# EasyEDA Pro project EasyEDAPro_River Gauge Rev 2_2026-01-11.epro

# Schematic Schematic1
Board Name: Board1; Create Date: 2026-01-03; Page Name: P1; Project Name: River Gauge Rev 2; Schematic Name: Schematic1; Update Date: 2026-01-04; Company: EasyEDA.com; Page Size: A4; Version: V1.0
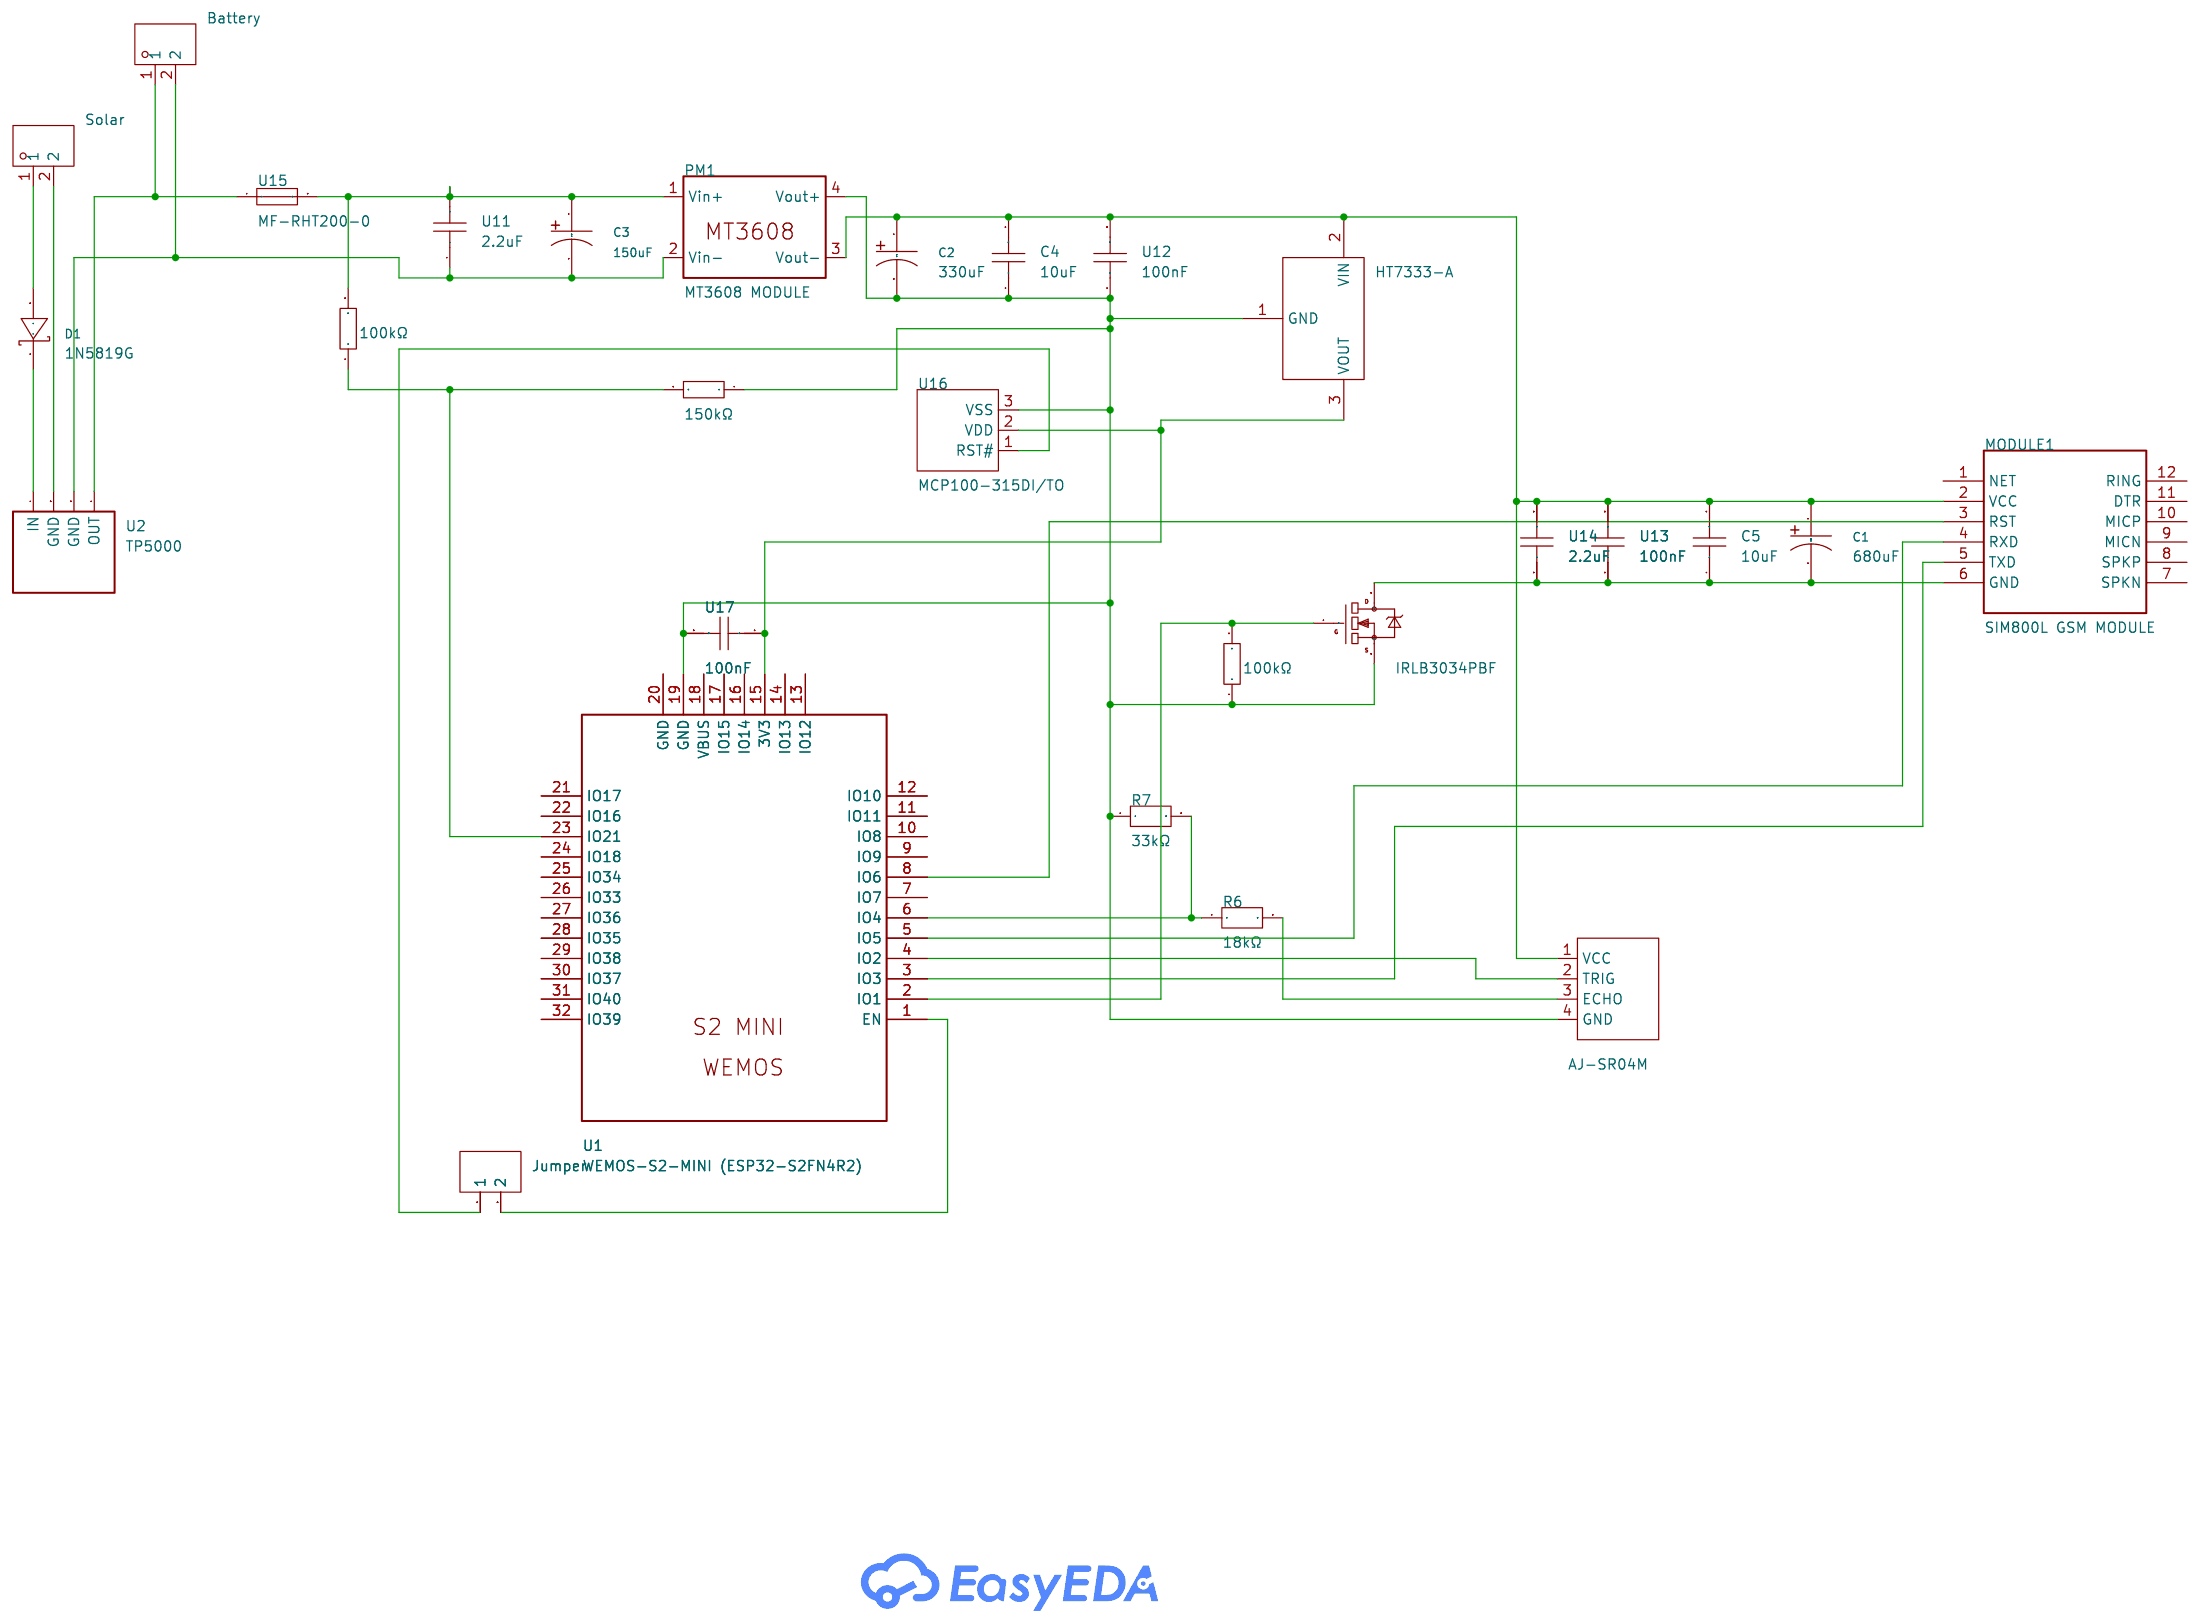
[diagram p0: schematic sheet]

## Parts
C1  680uF  [CAP-TH_BD8.0-P3.50-D0.6-FD_1]
C2  330uF  [CAP-TH_BD6.3-P2.50-D1.0-FD]
C3  150uF  [CAP-TH_BD6.3-P2.50-D1.0-FD]
C4  10uF  [CAP-TH_L4.5-W3.0-P2.50-D0.5]
C5  10uF  [CAP-TH_L4.5-W3.0-P2.50-D0.5]
D1  1N5819G  [DO-41_BD2.4-L4.7-P8.70-D0.9-RD]
H1  Jumper  [HDR-TH_2P-P2.54-V-F]
MODULE1  SIM800L GSM MODULE  [SIM800L GSM MODULE]
PM1  MT3608 MODULE  [MT3608]
Q2  IRLB3034PBF  [TO-220-3_L10.0-W4.5-P2.54-L]
R2  100kΩ  [RES-TH_BD4.5-L11.0-P15.00-D0.7]
R3  100kΩ  [RES-TH_BD4.5-L11.0-P15.00-D0.7]
R4  150kΩ  [RES-TH_BD4.5-L11.0-P15.00-D0.7]
R6  18kΩ  [RES-TH_BD2.4-L6.5-P10.50-D0.5]
R7  33kΩ  [RES-TH_BD2.4-L6.5-P10.50-D0.5]
U1  WEMOS-S2-MINI (ESP32-S2FN4R2)  [WEMOS-S2-MINI]
U2  TP5000  [TP5000]
U7  Solar  [CONN-TH_2P-P3.50_KEFA_KF2EDGJVC-3.5-2P]
U8  Battery  [CONN-TH_2P-P3.50_KEFA_KF2EDGJVC-3.5-2P]
U9  AJ-SR04M  [TH_HC-SR04V]
U10  HT7333-A  [TO-92-3_L5.1-W4.1-P1.27-L]
U11  2.2uF  [CAP-TH_L4.0-W2.5-P2.50-D0.5]
U12  100nF  [CAP-TH_L3.6-W2.3-P2.5-D0.6]
U13  100nF  [CAP-TH_L3.6-W2.3-P2.5-D0.6]
U14  2.2uF  [CAP-TH_L4.0-W2.5-P2.50-D0.5]
U15  MF-RHT200-0  [FUSE-TH_L9.4-W3.0-P5.10-D1.0-S2.10]
U16  MCP100-315DI/TO  [TO-92-3_L4.8-W3.7-P1.27-L]
U17  100nF  [CAP-TH_L3.6-W2.3-P2.5-D0.6]

## Library data of the parts
C1 = EEUFR1A681: Capacitance: Tolerance:±20% Tolerance:±20% Rated Voltage: Ripple Current:950mA@100kHz Equivalent Series Resistance(ESR):56mΩ@100kHz Lead Spacing: φD: L: Lifetime @ Temp:6000hrs@105℃ Operating Temperature:-40℃~+105℃ Operating Temperature:-40℃~+105℃; LCSC Part Name: 680uF ±20% 10V; Supplier Part: C407875; Manufacturer: PANASONIC(松下); Supplier Footprint: 插件,D8xL11.5mm; JLCPCB Part Class: Extended Part; Datasheet: https://atta.szlcsc.com/upload/public/pdf/source/20190724/C407875_2DF9F4B12A7B6FBBCD5E74906427567A.pdf; Supplier: LCSC; Tolerance: ±20%; Ripple Current: 950mA@100kHz; Equivalent Series Resistance(ESR): 56mΩ@100kHz; Lifetime @ Temp: 6000hrs@105℃; Operating Temperature: -40℃~+105℃
C2 C3 = EEUFS1A331: Capacitance:330uF Tolerance:±20% Tolerance:±20% Voltage Rating:10V Ripple Current:455mA@100kHz Equivalent Series Resistance(ESR):130mΩ@100kHz Pin Spacing:2.5mm Diameter:6.3mm Height - Seated (Max):11.2mm Lifetime:5000hrs@105℃ Operating Temperature:-40℃~+1; LCSC Part Name: 330uF ±20% 10V; Supplier Part: C407971; Manufacturer: PANASONIC(松下); Supplier Footprint: 插件,D6.3xL11.2mm; JLCPCB Part Class: Extended Part; Datasheet: https://item.szlcsc.com/datasheet/EEUFS1A331/396950.html; Supplier: LCSC; Tolerance: ±20%; Voltage Rating: 10V; Ripple Current: 455mA@100kHz; Equivalent Series Resistance(ESR): 130mΩ@100kHz; Pin Spacing: 2.5mm; Diameter: 6.3mm; Height - Seated (Max): 11.2mm; Lifetime: 5000hrs@105℃; Operating Temperature: -40℃~+105℃
C4 C5 = FG14X7R1A106KRT06: Capacitance: Tolerance:±10% Tolerance:±10% Voltage Rated:10V Temperature Coefficient:; LCSC Part Name: 10uF ±10% 10V; Supplier Part: C1623406; Manufacturer: TDK; Supplier Footprint: 插件; JLCPCB Part Class: Extended Part; Datasheet: https://atta.szlcsc.com/upload/public/pdf/source/20210603/7C07ADBE9CEF1AEE8735D13453ED6990.pdf; Supplier: LCSC; Tolerance: ±10%; Voltage Rated: 10V
D1 = 1N5819G: Voltage - Forward(Vf@If):600mV@1A Voltage - DC Reverse(Vr):40V Current - Rectified:1A Reverse Leakage Current (Ir):1mA@40V Operating Junction Temperature Range:-65℃~+125℃ Operating Junction Temperature Range:-65℃~+125℃ Non-Repetitive Peak Forward Surge Cu; LCSC Part Name: 电压:40V 电流:1A; Supplier Part: C232463; Manufacturer: onsemi(安森美); Supplier Footprint: DO-41; JLCPCB Part Class: Extended Part; Datasheet: https://item.szlcsc.com/datasheet/1N5819G/232386.html; Supplier: LCSC; Voltage - Forward(Vf@If): 600mV@1A; Voltage - DC Reverse(Vr): 40V; Current - Rectified: 1A; Reverse Leakage Current (Ir): 1mA@40V; Operating Junction Temperature Range: -65℃~+125℃; Non-Repetitive Peak Forward Surge Current: 25A
H1 = HDR-F_2.54_1x2P: Supplier Footprint: Through
MODULE1 = SIM800L GSM MODULE
PM1 = MT3608 MODULE: Supplier: AliExpress; link: https://www.banggood.com/1pcs-MT3608-2A-DC-DC-Adjustable-Step-Up-Power-Module-Booster-Power-Module-p-1213134.html?rmmds=myorder&cur_warehouse=CN
Q2 = IRLB3034PBF: Type:1个NChannel Drain Source Voltage (Vdss): Continuous Drain Current (Id): Power Dissipation (Pd): Drain Source On Resistance (RDS(on)@Vgs,Id):1.7mΩ@10V,195A Gate Threshold Voltage (Vgs(th)@Id):2.5V@250uA Total Gate Charge (Qg@Vgs):162nC@4.5V Input Capac; LCSC Part Name: 1个N沟道 耐压:40V 电流:195A; Supplier Part: C144151; Manufacturer: Infineon(英飞凌); Supplier Footprint: TO-220AB; JLCPCB Part Class: Extended Part; Datasheet: https://atta.szlcsc.com/upload/public/pdf/source/20171120/C148141_15111593205491130465.pdf; Supplier: LCSC; Type: 1个NChannel; Drain Source On Resistance (RDS(on)@Vgs,Id): 1.7mΩ@10V,195A; Gate Threshold Voltage (Vgs(th)@Id): 2.5V@250uA; Total Gate Charge (Qg@Vgs): 162nC@4.5V; Input Capacitance (Ciss@Vds): 10.315nF@25V; Operating Temperature: -55℃~+175℃@(Tj)
R2-R4 = MO2WS-100K±5%-TT63: Type:Metal Oxide Resistors Resistance:100kΩ Tolerance:±5% Tolerance:±5% Voltage-Supply(Max):400V Power(Watts):2W Temperature Coefficient:±350ppm/℃ Temperature Coefficient:±350ppm/℃ Operating Temperature:-55℃~+155℃ Operating Temperature:-55℃~+155℃; LCSC Part Name: 金属氧化膜电阻 100kΩ ±5% 2W 小体积; Supplier Part: C479462; Manufacturer: VO(翔胜); Supplier Footprint: 插件,D4.5xL11mm; JLCPCB Part Class: Extended Part; Datasheet: https://atta.szlcsc.com/upload/public/pdf/source/20200622/C479426_3144C92B6E787A18688D073F1B971656.pdf; Supplier: LCSC; Type: Metal Oxide Resistors; Tolerance: ±5%; Voltage-Supply(Max): 400V; Power(Watts): 2W; Temperature Coefficient: ±350ppm/℃; Operating Temperature: -55℃~+155℃
R6 R7 = RNF14FTC18K0: Type:Metal Film Resistors Resistance: Tolerance:±1% Tolerance:±1% Power(Watts):0.25W Temperature Coefficient:±50ppm/℃ Temperature Coefficient:±50ppm/℃ Operating Temperature Range:-55℃~+155℃ Operating Temperature Range:-55℃~+155℃; LCSC Part Name: 金属膜电阻 18kΩ ±1% 250mW; Supplier Part: C2588075; Manufacturer: SEI(Stackpole Electronics Inc.); Supplier Footprint: 插件,D2.4xL6.4mm; JLCPCB Part Class: Extended Part; Datasheet: https://atta.szlcsc.com/upload/public/pdf/source/20210416/CE3C3DFE1F0E2A8D22EC743938724C43.pdf; Supplier: LCSC; Type: Metal Film Resistors; Tolerance: ±1%; Power(Watts): 0.25W; Temperature Coefficient: ±50ppm/℃; Operating Temperature Range: -55℃~+155℃
U1 = WEMOS-S2-MINI (ESP32-S2FN4R2): Manufacturer: WEMOS; Manufacturer Part: Wemos; Supplier: WEMOS; Supplier Part: WEMOS_S2_MINI; link: https://www.wemos.cc/en/latest/s2/s2_mini.html?spm=a2g0o.detail.1000023.1.36da1596ZoDwKF
U2 = TP5000
U7 U8 = KF2EDGJVC-3.5-2P: Supplier Part: C9900094985; Supplier Footprint: CONN-TH_3P-P3.50_KEFA_KF2EDGJVC-3.5-2P; JLCPCB Part Class: Extended Part; Supplier: LCSC
U9 = HC-SR04: Supplier Part: C19857336; Manufacturer: Universal Microelectronics; JLCPCB Part Class: Extended Part; Datasheet: https://atta.szlcsc.com/upload/public/pdf/source/20240122/47B8E374E428935B7962A2189EF91AAC.pdf; Supplier: LCSC
U10 = HT7333-A: Output Type: Maximum Input Voltage:- Output Voltage:3.3V Output Voltage:3.3V MAX Output Current:- Power Supply Rejection Ratio (PSRR):- Dropout Voltage:- standby current:- Output Polarity:Positive electrode Number of Outputs:1; LCSC Part Name: 输出3.3V; Supplier Part: C73726; Manufacturer: HOLTEK(合泰/盛群); Supplier Footprint: TO-92-3; JLCPCB Part Class: Extended Part; Supplier: LCSC; Output Voltage: 3.3V; Output Polarity: Positive electrode; Number of Outputs: 1
U11 U14 = FG18X7R1A225KRT06: Capacitance: Tolerance:±10% Tolerance:±10% Voltage Rated:10V Temperature Coefficient:; LCSC Part Name: 2.2uF ±10% 10V; Supplier Part: C3693923; Manufacturer: TDK; JLCPCB Part Class: Extended Part; Supplier: LCSC; Tolerance: ±10%; Voltage Rated: 10V
U12 U13 U17 = K104K15X7RF53L2: Capacitance:100nF Tolerance:±10% Tolerance:±10% Voltage Rating:50V Temperature Coefficient:X7R; LCSC Part Name: 100nF ±10% 50V; Supplier Part: C1620173; Manufacturer: VISHAY(威世); Supplier Footprint: 插件,P=2.5mm; JLCPCB Part Class: Extended Part; Datasheet: https://item.szlcsc.com/datasheet/K104K15X7RF53L2/1711018.html; Supplier: LCSC; Tolerance: ±10%; Voltage Rating: 50V; Temperature Coefficient: X7R
U15 = MF-RHT200-0: Voltage - Max:- Current - Max:- Hold Current:- Trip Current:- Power Dissipation:1.4W Resistance - Initial (Ri) (Min):45mΩ Resistance - Post Trip (R1) (Max):110mΩ Time to Trip(Max):- Operating Temperature:-40℃~+125℃ Operating Temperature:-40℃~+125℃ Length:; Supplier Part: C3762533; Manufacturer: BOURNS; Supplier Footprint: 插件,P=5.1mm; JLCPCB Part Class: Extended Part; Datasheet: https://item.szlcsc.com/datasheet/MF-RHT200-0/4330064.html; Supplier: LCSC; Power Dissipation: 1.4W; Resistance - Initial (Ri) (Min): 45mΩ; Resistance - Post Trip (R1) (Max): 110mΩ; Operating Temperature: -40℃~+125℃
U16 = MCP100-315DI/TO: ChipType:Simple Reset/Power-On Reset Output Type:Push-pull Voltage - Supply:1V~5.5V Voltage - Supply:1V~5.5V Reset Active Level:Active Low Threshold Voltage:3.075V Number of Voltages Monitored:1 Reset Timeout:150ms Operating Temperature:-40℃~+85℃@(TA) Ope; LCSC Part Name: 带推挽输出的微控制器监控电路; Supplier Part: C631713; Manufacturer: MICROCHIP(美国微芯); Supplier Footprint: TO-92; JLCPCB Part Class: Extended Part; Datasheet: https://item.szlcsc.com/datasheet/MCP100-315DI%252FTO/661523.html; Supplier: LCSC; ChipType: Simple Reset/Power-On Reset; Output Type: Push-pull; Voltage - Supply: 1V~5.5V; Reset Active Level: Active Low; Threshold Voltage: 3.075V; Number of Voltages Monitored: 1; Reset Timeout: 150ms; Operating Temperature: -40℃~+85℃@(TA); Quiescent Current: 45uA

## Nets
$1N656: C1.2 C5.1 MODULE1.6(GND) Q2.2(D) U13.1 U14.1
$1N895: D1.2(A) U7.1
$1N900: U2.3(GND) U7.2
$1N906: C3.2 PM1.2(Vin-) U2.2(GND) U8.2 U11.1
$1N1032: H1.1 U16.1(RST#)
$1N1812: D1.1(K) U2.4(IN)
$1N1973: C3.1 PM1.1(Vin+) R3.2 U11.2 U15.2
$1N1979: U2.1(OUT) U8.1 U15.1
$1N2137: H1.2 U1.1(EN)
$1N2311: U1.15(3V3) U10.3(VOUT) U16.2(VDD) U17.1
$1N2333: MODULE1.5(TXD) U1.3(IO3)
$1N2338: MODULE1.3(RST) U1.8(IO6)
$1N2360: Q2.1(G) R2.2 U1.2(IO1)
$1N2448: MODULE1.4(RXD) U1.5(IO5)
$1N2559: U1.4(IO2) U9.2(TRIG)
$1N2629: C2.2 C4.1 PM1.4(Vout+) Q2.3(S) R2.1 R4.1 R7.1 U1.19(GND) U9.4(GND) U10.1(GND) U12.1 U16.3(VSS) U17.2
$1N2646: C1.1 C2.1 C4.2 C5.2 MODULE1.2(VCC) PM1.3(Vout-) U9.1(VCC) U10.2(VIN) U12.2 U13.2 U14.2
$1N2699: R3.1 R4.2 U1.23(IO21)
$1N2824: R6.2 U9.3(ECHO)
$1N2827: R6.1 R7.2 U1.6(IO4)

Not connected (* = marked no-connect by the designer): MODULE1 1(NET) 7(SPKN) 8(SPKP) 9(MICN) 10(MICP) 11(DTR) 12(RING); U1 7(IO7) 9(IO9) 10(IO8) 11(IO11) 12(IO10) 13(IO12) 14(IO13) 16(IO14) 17(IO15) 18(VBUS) 20(GND) 21(IO17) 22(IO16) 24(IO18) 25(IO34) 26(IO33) 27(IO36) 28(IO35) 29(IO38) 30(IO37) 31(IO40) 32(IO39)

# Board PCB1
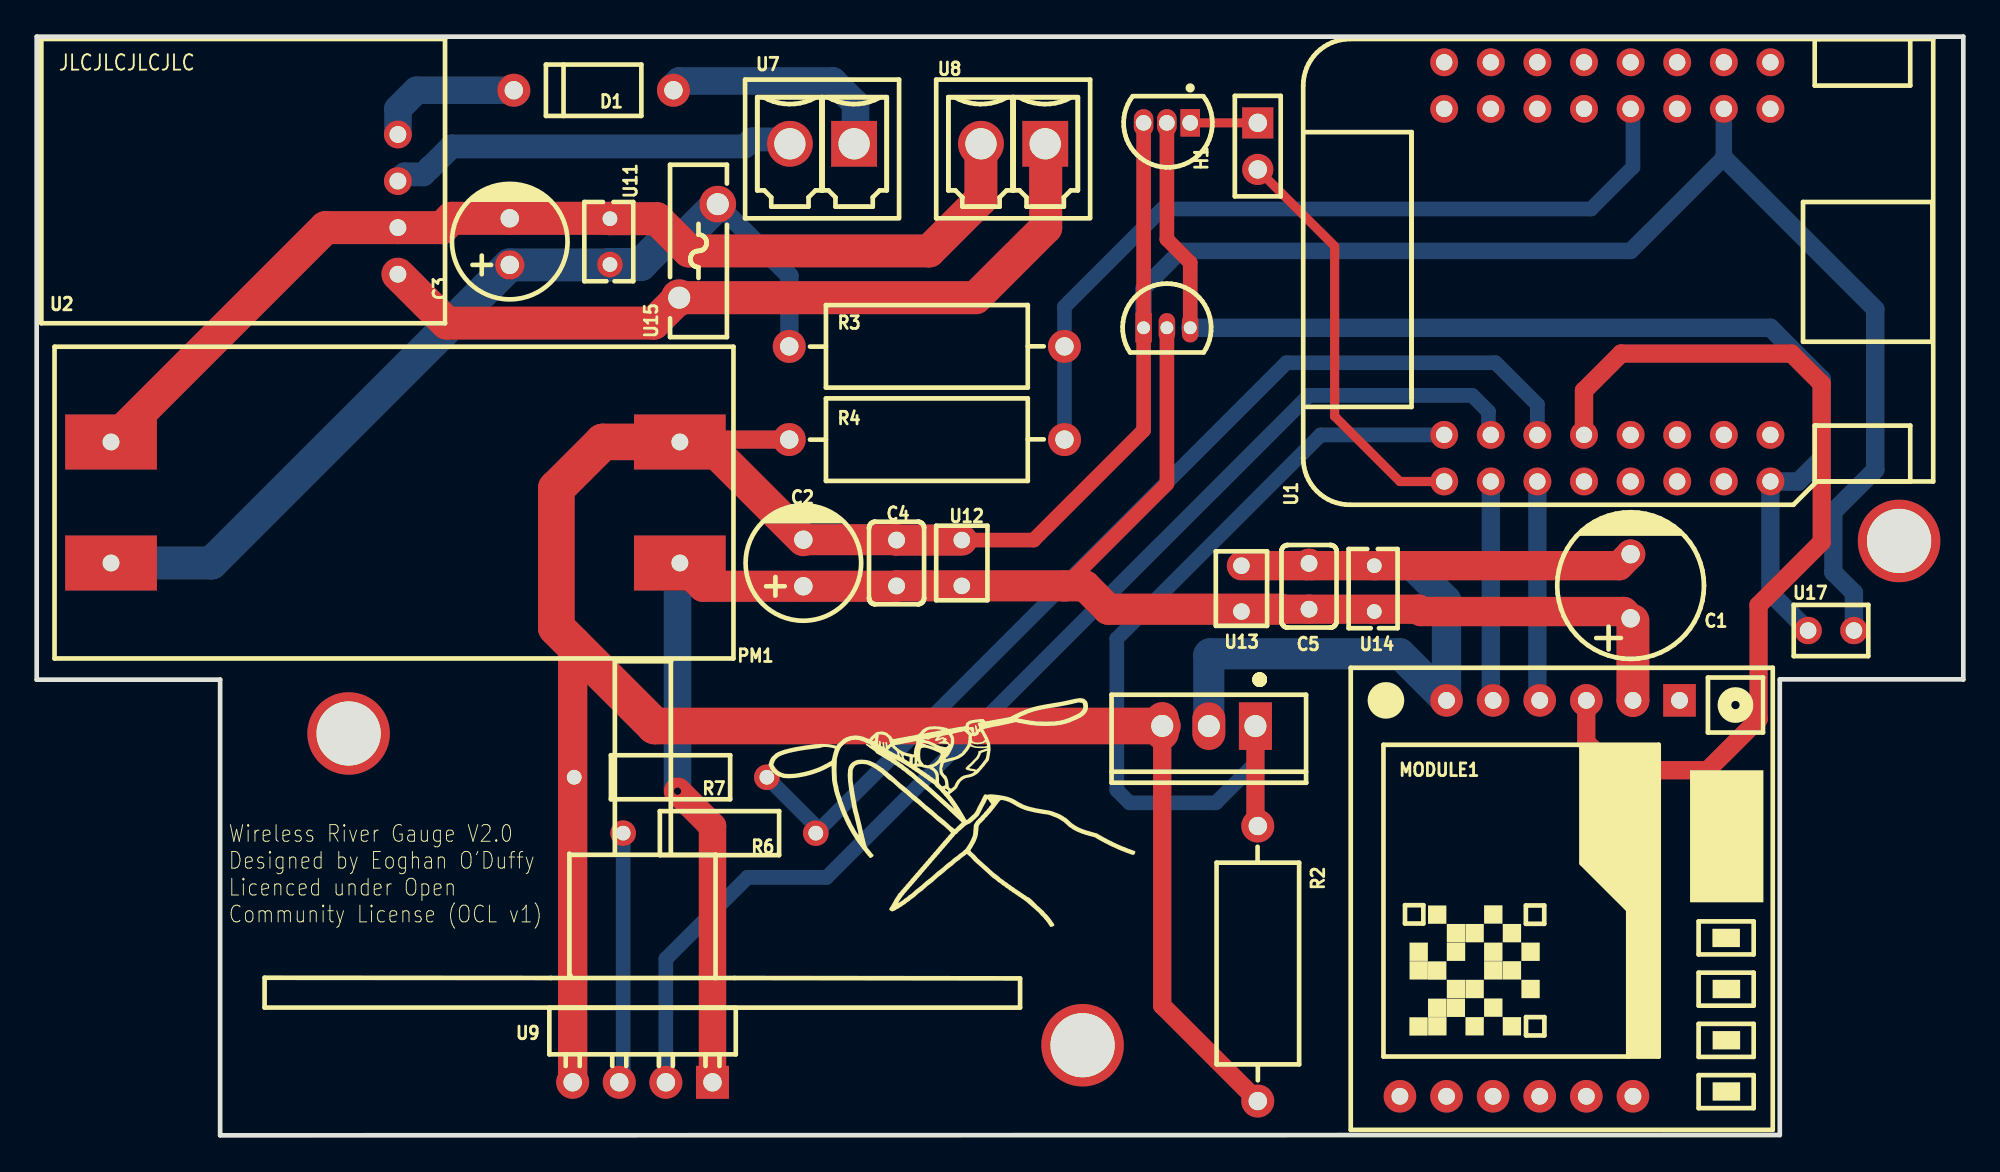
[diagram p1: board, top side]
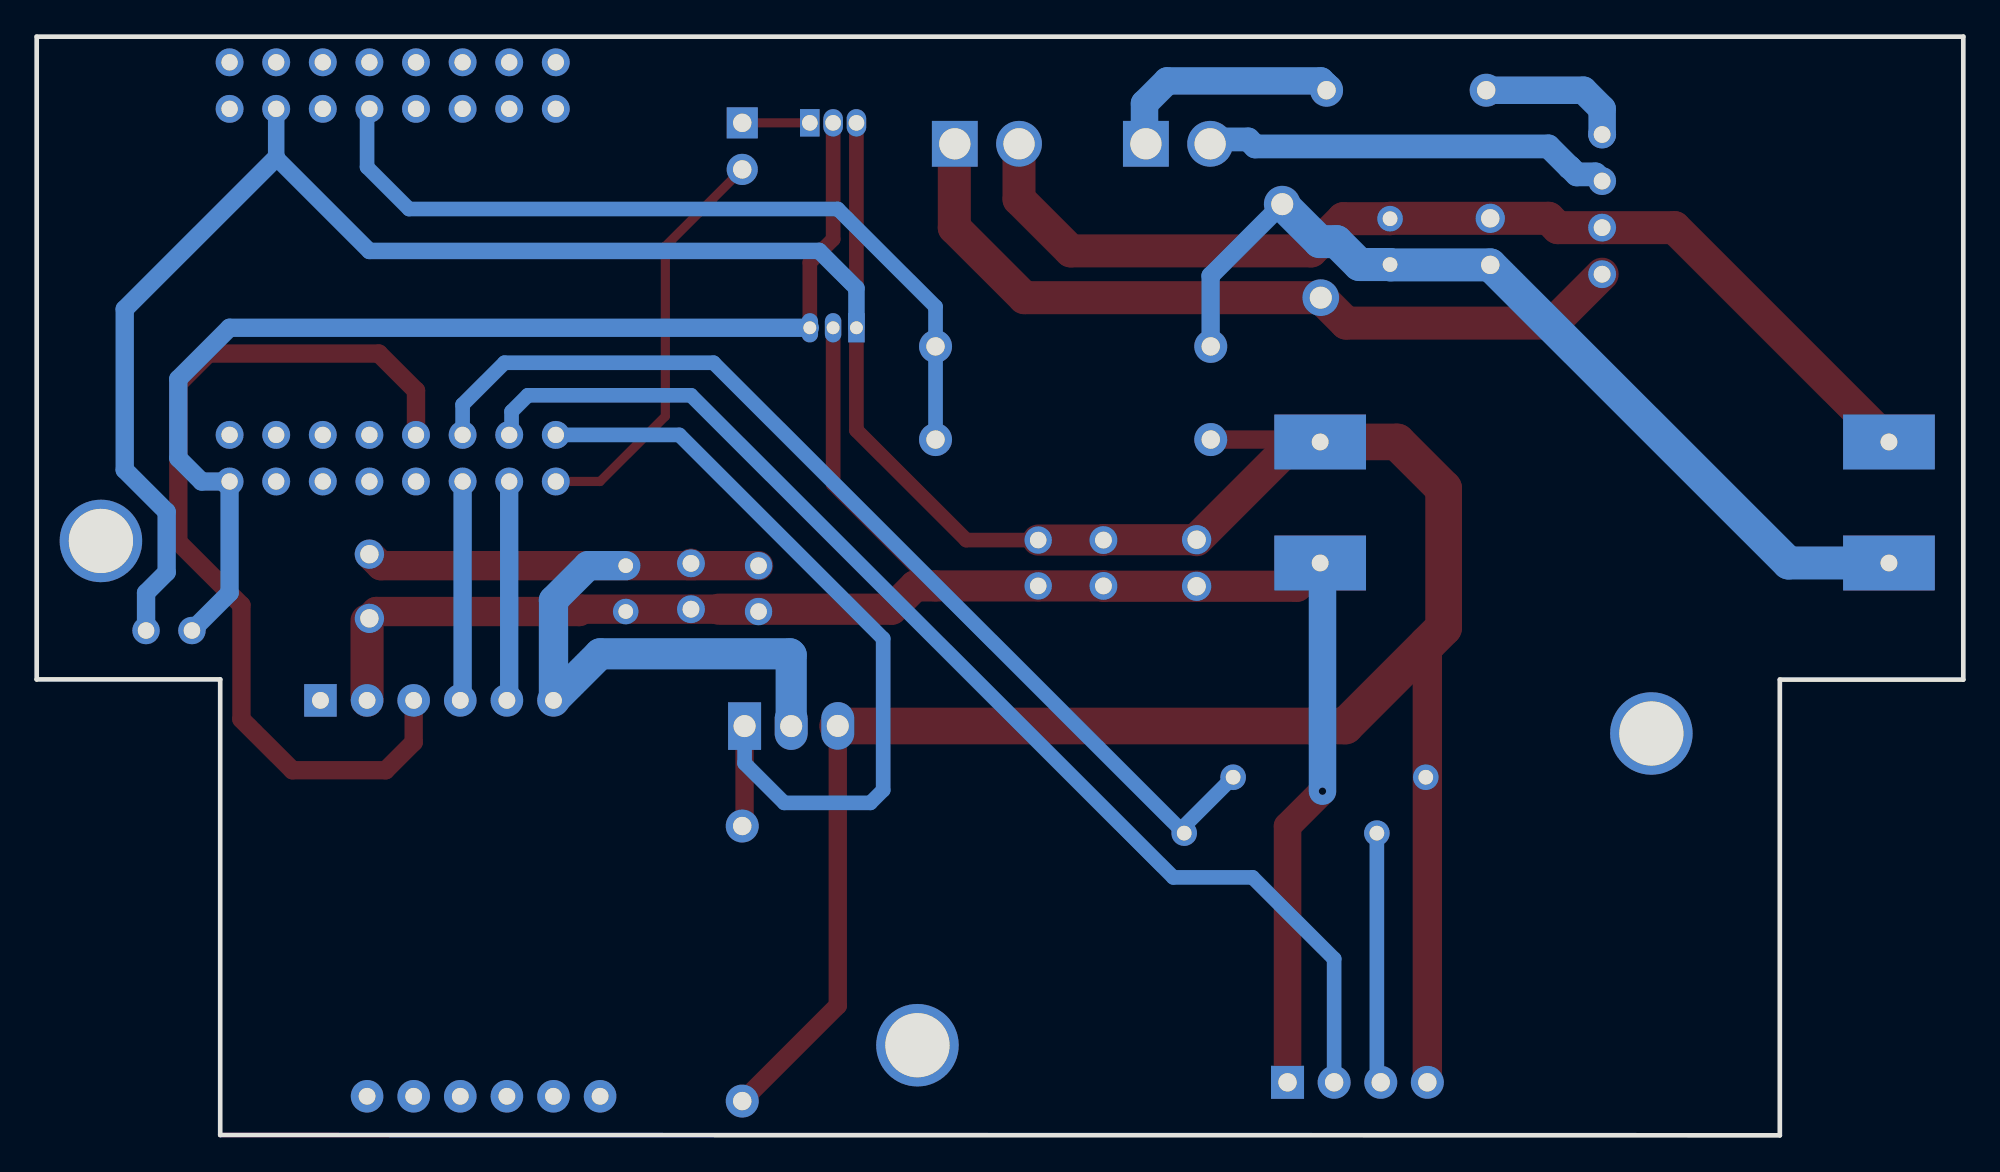
[diagram p2: board, bottom side, seen from below]

Outline 105 x 59.91 mm; copper layers: Top Layer, Bottom Layer. Coordinates in mm from the lower left corner of the outline.
Outline path: 0,59.91 0,24.85 10,24.85 10,0 95,0.02 95,24.86 105,24.86 105,59.91 0,59.91
Stack: Top Layer 0.035mm / Dielectric1 1.51mm FR4 er 4.5 / Bottom Layer 0.035mm

## Design rules (mm)
template: JLCPCB Capability(Two Layers Board)
spacing copperThickness1oz (default): track to track 0.102, other pairs 0.152 to 0.3
spacing copperThickness2oz: track to track 0.203, other pairs 0.152 to 0.3
track width copperThickness1oz (default): min 0.127, default 0.254, max 2.54
track width copperThickness2oz: min 0.203, default 0.254, max 2.54
differential pair differentialPair (default): width min 0.127, default 0.254, max 2.54; gap min 0.152, default 0.152
via viaSize (default): diameter min 0.5, default 0.61, max 10; hole min 0.3, default 0.305, max 6.3

## Placement (name value [footprint] x y rotation side)
C1  680uF  [CAP-TH_BD8.0-P3.50-D0.6-FD_1]  86.87 29.94 90 top
C2  330uF  [CAP-TH_BD6.3-P2.50-D1.0-FD]  41.78 31.21 90 top
C3  150uF  [CAP-TH_BD6.3-P2.50-D1.0-FD]  25.78 48.74 90 top
C4  10uF  [CAP-TH_L4.5-W3.0-P2.50-D0.5]  46.86 31.21 270 top
C5  10uF  [CAP-TH_L4.5-W3.0-P2.50-D0.5]  69.34 29.94 270 top
D1  1N5819G  [DO-41_BD2.4-L4.7-P8.70-D0.9-RD]  30.35 56.99 0 top
H1  Jumper  [HDR-TH_2P-P2.54-V-F]  66.55 53.94 270 top
MODULE1  -  [SIM800L GSM MODULE]  89.53 23.72 270 top
NOREF  -  [Pad_e649]  57 4.91 0 top
NOREF#2  -  [Pad_e646]  101.5 32.41 0 top
NOREF#3  -  [Pad_e650]  17 21.91 0 top
PM1  MT3608 MODULE  [MT3608]  37.97 26 180 top
Q2  IRLB3034PBF  [TO-220-3_L10.0-W4.5-P2.54-L]  63.88 22.32 180 top
R2  100kΩ  [RES-TH_BD4.5-L11.0-P15.00-D0.7]  66.55 9.37 90 top
R3  100kΩ  [RES-TH_BD4.5-L11.0-P15.00-D0.7]  48.51 43.02 180 top
R4  150kΩ  [RES-TH_BD4.5-L11.0-P15.00-D0.7]  48.51 37.94 0 top
R6  18kΩ  [RES-TH_BD2.4-L6.5-P10.50-D0.5]  37.21 16.48 180 top
R7  33kΩ  [RES-TH_BD2.4-L6.5-P10.50-D0.5]  34.54 19.53 0 top
U1  WEMOS-S2-MINI (ESP32-S2FN4R2)  [WEMOS-S2-MINI]  84.07 47.09 90 top
U2  -  [TP5000]  19.69 46.96 0 top
U7  Solar  [CONN-TH_2P-P3.50_KEFA_KF2EDGJVC-3.5-2P]  42.8 54.07 180 top
U8  Battery  [CONN-TH_2P-P3.50_KEFA_KF2EDGJVC-3.5-2P]  53.21 54.07 180 top
U9  AJ-SR04M  [TH_HC-SR04V]  33.02 2.89 180 top
U10  HT7333-A  [TO-92-3_L5.1-W4.1-P1.27-L]  61.59 44.04 0 top
U11  2.2uF  [CAP-TH_L4.0-W2.5-P2.50-D0.5]  31.24 48.74 270 top
U12  100nF  [CAP-TH_L3.6-W2.3-P2.5-D0.6]  50.42 31.21 270 top
U13  100nF  [CAP-TH_L3.6-W2.3-P2.5-D0.6]  65.66 29.81 270 top
U14  2.2uF  [CAP-TH_L4.0-W2.5-P2.50-D0.5]  72.9 29.81 270 top
U15  MF-RHT200-0  [FUSE-TH_L9.4-W3.0-P5.10-D1.0-S2.10]  36.07 48.23 90 top
U16  MCP100-315DI/TO  [TO-92-3_L4.8-W3.7-P1.27-L]  61.59 55.21 180 top
U17  100nF  [CAP-TH_L3.6-W2.3-P2.5-D0.6]  97.79 27.53 0 top

## Footprints (pads in the part's own frame, mm; a bottom-side part is the same pattern mirrored in y, then rotated)
CAP-TH_BD6.3-P2.50-D1.0-FD
  round 1.6 hole 1: 1(-1.27,0) 2(1.27,0)
CAP-TH_BD8.0-P3.50-D0.6-FD_1
  round 1.6 hole 1: 1(-1.75,0) 2(1.75,0)
CAP-TH_L3.6-W2.3-P2.5-D0.6
  round 1.5 hole 0.9: 1(-1.25,0) 2(1.25,0)
CAP-TH_L4.0-W2.5-P2.50-D0.5
  round 1.4 hole 0.8: 1(-1.25,0) 2(1.25,0)
CAP-TH_L4.5-W3.0-P2.50-D0.5
  round 1.524 hole 0.914: 1(-1.25,0) 2(1.25,0)
CONN-TH_2P-P3.50_KEFA_KF2EDGJVC-3.5-2P
  rect 2.5x2.5 hole 1.7: 1(-1.75,0)
  round 2.5 hole 1.7: 2(1.75,0)
DO-41_BD2.4-L4.7-P8.70-D0.9-RD
  round 1.8 hole 1: 1(-4.35,0) 2(4.35,0)
FUSE-TH_L9.4-W3.0-P5.10-D1.0-S2.10
  round 2 hole 1.2: 1(-2.55,1.05) 2(2.55,-1.05)
HDR-TH_2P-P2.54-V-F
  rect 1.7x1.7 hole 1: 1(-1.27,0)
  round 1.7 hole 1: 2(1.27,0)
MT3608
  rect 5x3 hole 0.914: 1(33.921,-5.207) 2(33.921,-11.807) 3(2.921,-5.207) 4(2.921,-11.807)
Pad_e646
  round 4.5 hole 3.5: 1(0,0)
Pad_e649
  round 4.5 hole 3.5: 1(0,0)
Pad_e650
  round 4.5 hole 3.5: 1(0,0)
RES-TH_BD2.4-L6.5-P10.50-D0.5
  round 1.4 hole 0.8: 1(-5.25,0) 2(5.25,0)
RES-TH_BD4.5-L11.0-P15.00-D0.7
  round 1.8 hole 1: 1(-7.5,0) 2(7.5,0)
SIM800L GSM MODULE
  rect 1.778x1.778 hole 0.914: 1(0,0)
  round 1.778 hole 0.914: 2(0,-2.54) 3(0,-5.08) 4(0,-7.62) 5(0,-10.16) 6(0,-12.7) 7(21.59,-15.24) 8(21.59,-12.7) 9(21.59,-10.16) 10(21.59,-7.62) 11(21.59,-5.08) 12(21.59,-2.54)
TH_HC-SR04V
  rect 1.8x1.8 hole 1.001: 1(-3.81,0)
  round 1.8 hole 1.001: 2(-1.27,0) 3(1.27,0) 4(3.81,0)
TO-92-3_L4.8-W3.7-P1.27-L
  rect 1.07x1.5 hole 0.85: 1(-1.27,0)
  oval 1.07x1.5 hole 0.85: 2(0,0) 3(1.27,0)
TO-92-3_L5.1-W4.1-P1.27-L
  rect 0.9x1.6 hole 0.7: 1(-1.27,0)
  oval 0.9x1.6 hole 0.7: 2(0,0) 3(1.27,0)
TO-220-3_L10.0-W4.5-P2.54-L
  rect 1.8x2.6 hole 1.2: 1(-2.54,0.005)
  oval 1.8x2.6 hole 1.2: 2(0,0.005) 3(2.54,-0.005)
TP5000
  round 1.524 hole 0.914: 1(0,0) 2(0,2.54) 3(0,5.08) 4(0,7.62)
WEMOS-S2-MINI
  round 1.524 hole 0.889: 1(-11.43,7.366) 2(-8.89,7.366) 3(-11.43,4.826) 4(-8.89,4.826) 5(-11.43,2.286) 6(-8.89,2.286) 7(-11.43,-0.254) 8(-8.89,-0.254) 9(-11.43,-2.794) 10(-8.89,-2.794) 11(-11.43,-5.334) 12(-8.89,-5.334) 13(-11.43,-7.874) 14(-8.89,-7.874) 15(-11.43,-10.414) 16(-8.89,-10.414) 17(8.89,-10.414) 18(11.43,-10.414) 19(8.89,-7.874) 20(11.43,-7.874) 21(8.89,-5.334) 22(11.43,-5.334) 23(8.89,-2.794) 24(11.43,-2.794) 25(8.89,-0.254) 26(11.43,-0.254) 27(8.89,2.286) 28(11.43,2.286) 29(8.89,4.826) 30(11.43,4.826) 31(8.89,7.366) 32(11.43,7.366)

## Nets
As in the schematic.

Pads without a net: MODULE1 1 7 8 9 10 11 12; NOREF 1; NOREF#2 1; NOREF#3 1; U1 7 9 10 11 12 13 14 16 17 18 20 21 22 24 25 26 27 28 29 30 31 32

## Via types
v1: diameter 0.8, hole 0.4, Top Layer to Bottom Layer, 1 via

## Routing (per net, layer and track width the routed paths; a pad name or vN(x,y) marks a point on that pad's centre or on a via; arc(x,y) is an arc through that point)
$1N656: length 49.7
  Top Layer w1.6: C1.2 86.24,31.06 U14.1 69.47,31.06 C5.1 69.22,31.06 U13.1
  Bottom Layer w1.6: U14.1 74.95,31.06 76.84,29.18 MODULE1.6
  Bottom Layer w1.7: Q2.2 63.88,26.2 63.94,26.26 74.29,26.26 MODULE1.6
$1N895: length 13
  Bottom Layer w1.5: D1.2 34.78,57.07 34.78,57.26 35.02,57.5 43.39,57.5 44.62,56.27 44.62,54.15 U7.1
$1N900: length 22.4
  Bottom Layer w1.3: U7.2 40.81,54.31 38.97,54.31 38.59,53.93 22.61,53.93 21.46,52.79 21.45,52.79 21.07,52.4 20.05,52.4 U2.3
$1N906: length 57.4
  Top Layer w1.8: U8.2 51.46,51.05 48.64,48.23 35.55,48.23 33.79,49.99 U11.1 31.22,50.01 C3.2 22.61,50.01 22.1,49.5 U2.2 15.74,49.5 PM1.2
$1N1032: length 3.7
  Top Layer w0.5: U16.1 H1.1
$1N1812: length 8.1
  Bottom Layer w1.5: U2.4 19.69,55.98 20.7,56.99 D1.1
$1N1973: length 50.5
  Bottom Layer w1: U15.2 41.02,46.88 41.02,43.03 R3.2
  Bottom Layer w1.8: U15.2 35.08,48.74 34.16,48.74 32.91,47.49 U11.2 31.22,47.47 C3.1 9.53,31.21 PM1.1
$1N1979: length 43.2
  Top Layer w1.8: U8.1 54.99,54.04 54.99,49.5 51.17,45.68 U15.1 33.63,44.29 22.35,44.29 U2.1
$1N2137: length 22.6
  Top Layer w0.5: 66.55,52.67 70.74,48.48 70.74,39.21 74.29,35.66 U1.1
$1N2311: length 63.9
  Top Layer w0.8: U10.3 62.87,47.59 61.59,48.86 U16.2
  Bottom Layer w1: U10.3 94.49,44.04 97.28,41.24 97.28,36.93 96.01,35.66 U1.15 94.49,29.58 U17.1
$1N2333: length 12
  Bottom Layer w1: U1.3 79.25,23.85 MODULE1.5
$1N2338: length 50.1
  Top Layer w1: U1.8 84.33,40.61 86.35,42.63 95.64,42.63 97.28,40.99 97.28,32.35 93.84,28.92 93.84,22.69 91.06,19.91 85.98,19.91 84.46,21.43 84.46,23.72
$1N2360: length 47
  Top Layer w1: R2.2 66.42,16.99 Q2.1
  Bottom Layer w0.8: U1.2 69.98,38.2 58.87,27.09 58.87,18.83 59.56,18.13 64.26,18.13 66.42,20.29 Q2.1
$1N2448: length 12
  Bottom Layer w1: MODULE1.4 81.79,23.85 U1.5
$1N2559: length 66
  Bottom Layer w0.8: U9.2 34.29,9.62 38.74,14.07 43.05,14.07 69.34,40.36 78.23,40.36 79.12,39.47 79.12,38.32 U1.4
$1N2629: length 219.9
  Top Layer w0.8: U12.1 54.34,32.46 60.32,38.45 U10.1 U16.3
  Top Layer w1: R2.1 61.34,7.07 Q2.3 ; R4.1 35.18,37.94 PM1.4
  Top Layer w1.6: U9.4 29.21,26.8
  Top Layer w1.7: U12.1 C4.1 46.84,32.48 C2.2
  Top Layer w1.8: C2.2 36.45,37.81 PM1.4
  Top Layer w2: PM1.4 30.86,37.81 28.32,35.28 28.32,27.69 33.69,22.32 61.34,22.32 Q2.3
  Bottom Layer w0.9: U1.19 91.95,53.31 86.87,48.23 62.36,48.23 60.32,46.2 U10.1
  Bottom Layer w1: U17.2 99.04,29.58 97.92,30.7 97.92,34.01 100.2,36.29 100.2,45.05 91.95,53.31
$1N2646: length 103
  Top Layer w0.8: U10.2 61.59,35.53 56.03,29.96
  Top Layer w1.5: v1(34.93,18.77) 36.83,16.86 U9.1
  Top Layer w1.6: 67.82,28.69 C5.2 75.31,28.69 75.44,28.56 86.5,28.56 C1.1
  Top Layer w1.7: 67.82,28.69 58.4,28.69 57.13,29.96 U12.2 C4.2 46.84,29.94 C2.1 36.32,29.94 PM1.3
  Top Layer w1.8: 87,28.06 MODULE1.2
  Bottom Layer w1.5: v1(34.93,18.77) 34.93,31.08 PM1.3
$1N2699: length 44.6
  Bottom Layer w0.8: U1.23 87,55.85 87,52.8 84.71,50.52 61.34,50.52 56.01,45.19 R3.1 R4.2
$1N2824: length 13.7
  Bottom Layer w0.8: U9.3 31.96,3.1 R6.2
$1N2827: length 56.7
  Bottom Layer w0.8: U1.6 81.79,39.85 79.5,42.13 68.12,42.13 R6.1 42.46,16.86 R7.2

## Text on the board
Top Silkscreen Layer: JLCJLCJLCJLC | Wireless River Gauge V2.0 / Designed by Eoghan O'Duffy / Licenced under Open / Community License (OCL v1)
